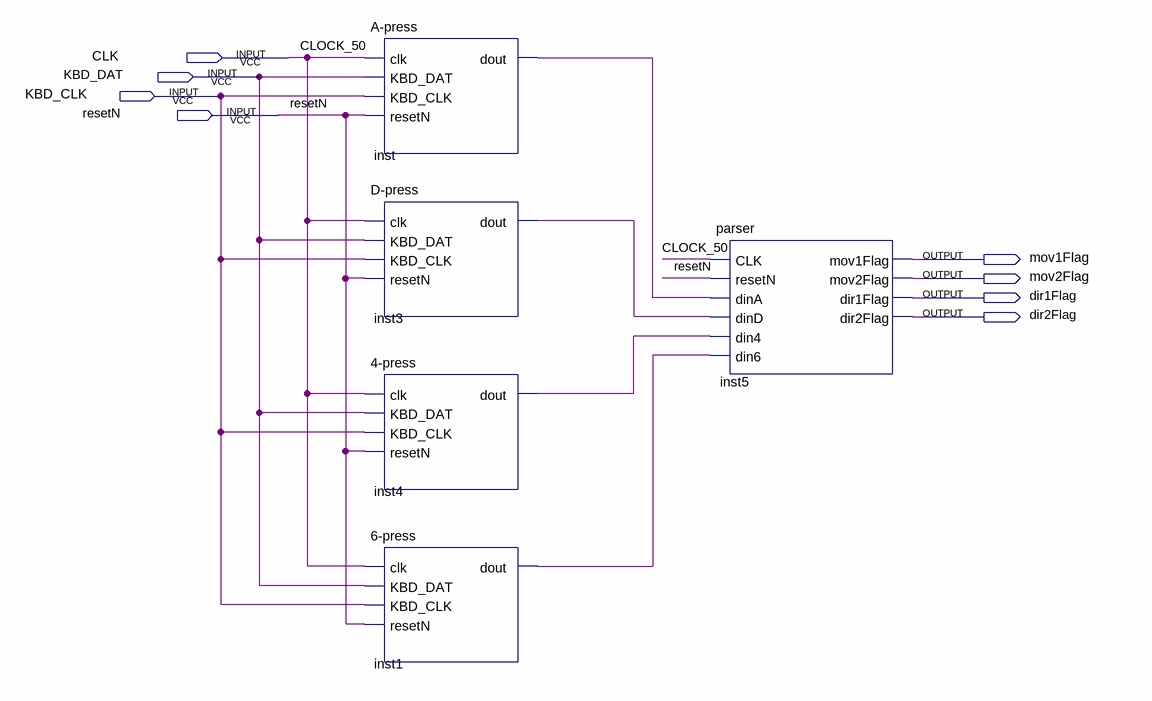
[diagram p0: schematic sheet]
// Quartus schematic KEYBOARD.bdf as structural Verilog: 5 symbols, 8 pins
module KEYBOARD (
  input  CLK,
  input  KBD_DAT,
  input  KBD_CLK,
  input  resetN,
  output mov1Flag,
  output mov2Flag,
  output dir1Flag,
  output dir2Flag
);

  wire inst1_dout, inst3_dout, inst4_dout, inst_dout;

  \A-press  inst (.clk(CLK), .KBD_DAT(KBD_DAT), .KBD_CLK(KBD_CLK), .resetN(resetN), .dout(inst_dout));
  \D-press  inst3 (.clk(CLK), .KBD_DAT(KBD_DAT), .KBD_CLK(KBD_CLK), .resetN(resetN), .dout(inst3_dout));
  \4-press  inst4 (.clk(CLK), .KBD_DAT(KBD_DAT), .KBD_CLK(KBD_CLK), .resetN(resetN), .dout(inst4_dout));
  \6-press  inst1 (.clk(CLK), .KBD_DAT(KBD_DAT), .KBD_CLK(KBD_CLK), .resetN(resetN), .dout(inst1_dout));
  parser inst5 (
    .CLK(CLK), .resetN(resetN), .dinA(inst_dout), .dinD(inst3_dout), .din4(inst4_dout), .din6(inst1_dout),
    .mov1Flag(mov1Flag), .mov2Flag(mov2Flag), .dir1Flag(dir1Flag), .dir2Flag(dir2Flag));

  // Other names for the same wires on the sheet: CLOCK_50 = CLK
endmodule
